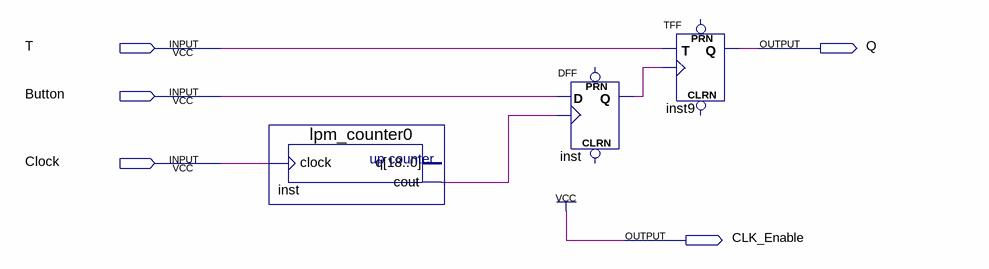
[diagram p0: schematic sheet]
// Quartus schematic lab4_4.bdf as structural Verilog: 3 symbols, 5 pins
module lab4_4 (
  input  T,
  input  Button,
  input  Clock,
  output Q,
  output CLK_Enable
);

  wire inst_cout, inst_q;

  lpm_counter0 inst (.clock(Clock), .cout(inst_cout));  // open: q
  DFF inst_dup2 (.CLK(inst_cout), .D(Button), .Q(inst_q));  // open: CLRN, PRN
  TFF inst9 (.T(T), .CLK(inst_q), .Q(Q));  // open: PRN, CLRN

  assign CLK_Enable = 1'b1;
endmodule
